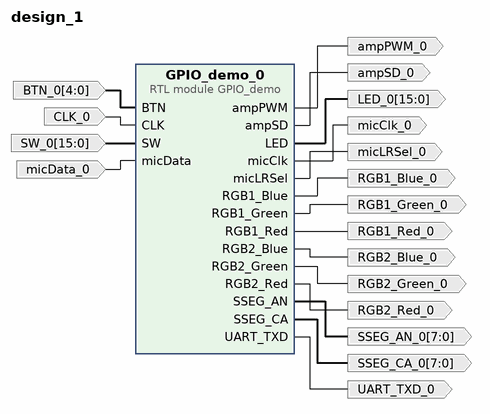
[diagram p0: block diagram of the top level]
# Vivado block design design_1, xc7a100tcsg324-1, Vivado 2021.2
create_bd_design design_1

create_bd_port -dir O -from 15 -to 0 LED_0
create_bd_port -dir O -from 7 -to 0 SSEG_CA_0
create_bd_port -dir I -from 4 -to 0 BTN_0
create_bd_port -dir I -type clk CLK_0
create_bd_port -dir O RGB1_Blue_0
create_bd_port -dir O RGB1_Green_0
create_bd_port -dir O RGB1_Red_0
create_bd_port -dir O RGB2_Blue_0
create_bd_port -dir O RGB2_Green_0
create_bd_port -dir O RGB2_Red_0
create_bd_port -dir O -from 7 -to 0 SSEG_AN_0
create_bd_port -dir I -from 15 -to 0 SW_0
create_bd_port -dir O UART_TXD_0
create_bd_port -dir O ampPWM_0
create_bd_port -dir O ampSD_0
create_bd_port -dir O micClk_0
create_bd_port -dir I micData_0
create_bd_port -dir O micLRSel_0

create_bd_cell -type module -reference GPIO_demo GPIO_demo_0

# ---- connections ----

connect_bd_net -net BTN_0_1 [get_bd_ports BTN_0] [get_bd_pins GPIO_demo_0/BTN]
connect_bd_net -net CLK_0_1 [get_bd_ports CLK_0] [get_bd_pins GPIO_demo_0/CLK]
connect_bd_net [get_bd_pins GPIO_demo_0/LED] [get_bd_ports LED_0]
connect_bd_net [get_bd_pins GPIO_demo_0/RGB1_Blue] [get_bd_ports RGB1_Blue_0]
connect_bd_net [get_bd_pins GPIO_demo_0/RGB1_Green] [get_bd_ports RGB1_Green_0]
connect_bd_net [get_bd_pins GPIO_demo_0/RGB1_Red] [get_bd_ports RGB1_Red_0]
connect_bd_net [get_bd_pins GPIO_demo_0/RGB2_Blue] [get_bd_ports RGB2_Blue_0]
connect_bd_net [get_bd_pins GPIO_demo_0/RGB2_Green] [get_bd_ports RGB2_Green_0]
connect_bd_net [get_bd_pins GPIO_demo_0/RGB2_Red] [get_bd_ports RGB2_Red_0]
connect_bd_net [get_bd_pins GPIO_demo_0/SSEG_AN] [get_bd_ports SSEG_AN_0]
connect_bd_net [get_bd_pins GPIO_demo_0/SSEG_CA] [get_bd_ports SSEG_CA_0]
connect_bd_net [get_bd_pins GPIO_demo_0/UART_TXD] [get_bd_ports UART_TXD_0]
connect_bd_net [get_bd_pins GPIO_demo_0/ampPWM] [get_bd_ports ampPWM_0]
connect_bd_net [get_bd_pins GPIO_demo_0/ampSD] [get_bd_ports ampSD_0]
connect_bd_net [get_bd_pins GPIO_demo_0/micClk] [get_bd_ports micClk_0]
connect_bd_net [get_bd_pins GPIO_demo_0/micLRSel] [get_bd_ports micLRSel_0]
connect_bd_net -net SW_0_1 [get_bd_ports SW_0] [get_bd_pins GPIO_demo_0/SW]
connect_bd_net -net micData_0_1 [get_bd_ports micData_0] [get_bd_pins GPIO_demo_0/micData]

validate_bd_design
save_bd_design
